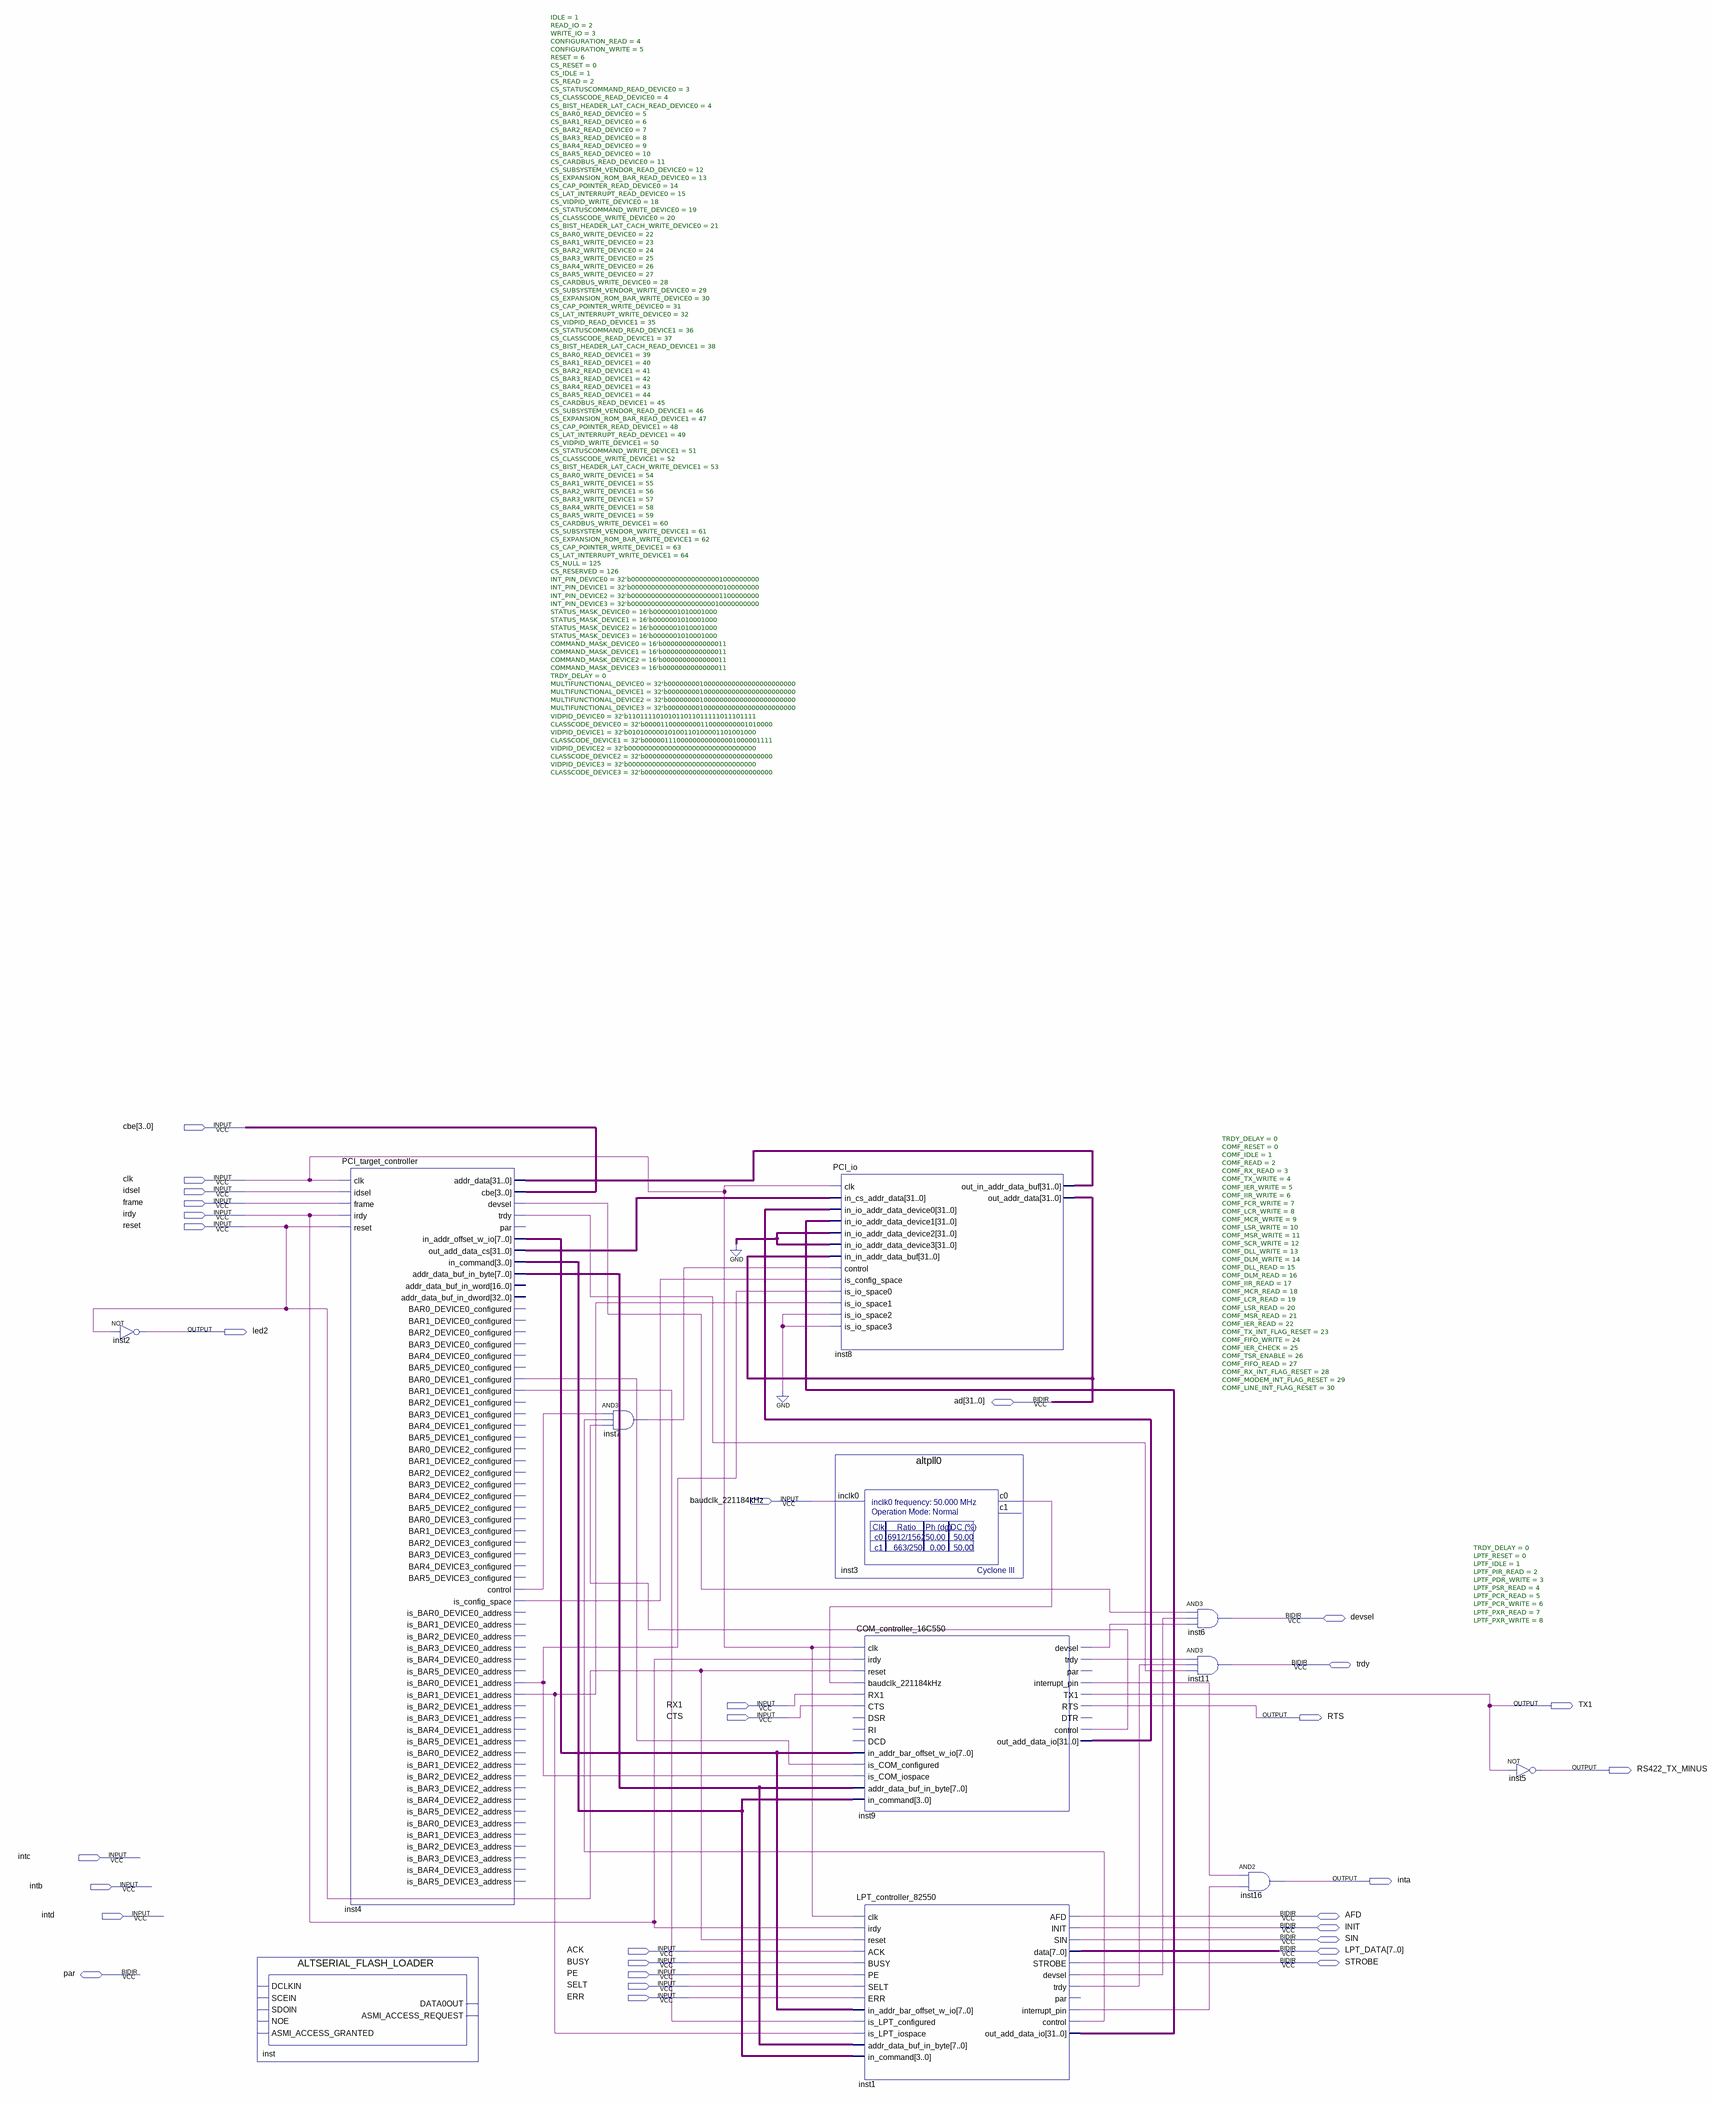
[diagram p0: schematic sheet]
// Quartus schematic Block1.bdf as structural Verilog: 12 symbols, 31 pins
module Block1 (
  input  [3:0] cbe,
  input  clk,
  input  idsel,
  input  frame,
  input  irdy,
  input  reset,
  input  baudclk_221184kHz,
  input  RX1,
  input  CTS,
  input  intc,
  input  intb,
  input  intd,
  input  ACK,
  input  BUSY,
  input  PE,
  input  SELT,
  input  ERR,
  inout  [31:0] ad,
  inout  devsel,
  inout  trdy,
  inout  AFD,
  inout  INIT,
  inout  SIN,
  inout  [7:0] LPT_DATA,
  inout  STROBE,
  inout  par,
  output led2,
  output TX1,
  output RTS,
  output RS422_TX_MINUS,
  output inta
);

  wire inst1_control, inst1_devsel, inst1_interrupt_pin, inst1_trdy, inst3_c0, inst4_bar0_device1_configured,
       inst4_bar1_device1_configured, inst4_control, inst4_devsel, inst4_is_bar0_device1_address,
       inst4_is_bar1_device1_address, inst4_is_config_space, inst4_trdy, inst7_out, inst9_control,
       inst9_devsel, inst9_interrupt_pin, inst9_trdy;
  wire [3:0] inst4_in_command;
  wire [7:0] inst4_addr_data_buf_in_byte, inst4_in_addr_offset_w_io;
  wire [31:0] inst1_out_add_data_io, inst4_addr_data, inst4_out_add_data_cs, inst9_out_add_data_io;

  not inst2 (led2, reset);
  ALTSERIAL_FLASH_LOADER inst ();  // open: DCLKIN, SCEIN, SDOIN, NOE, ASMI_ACCESS_GRANTED, DATA0OUT, ASMI_ACCESS_REQUEST
  PCI_target_controller #(.IDLE(1), .READ_IO(2), .WRITE_IO(3), .CONFIGURATION_READ(4), .CONFIGURATION_WRITE(5), .RESET(6), .CS_RESET(0), .CS_IDLE(1), .CS_READ(2), .CS_STATUSCOMMAND_READ_DEVICE0(3), .CS_CLASSCODE_READ_DEVICE0(4), .CS_BIST_HEADER_LAT_CACH_READ_DEVICE0(4), .CS_BAR0_READ_DEVICE0(5), .CS_BAR1_READ_DEVICE0(6), .CS_BAR2_READ_DEVICE0(7), .CS_BAR3_READ_DEVICE0(8), .CS_BAR4_READ_DEVICE0(9), .CS_BAR5_READ_DEVICE0(10), .CS_CARDBUS_READ_DEVICE0(11), .CS_SUBSYSTEM_VENDOR_READ_DEVICE0(12), .CS_EXPANSION_ROM_BAR_READ_DEVICE0(13), .CS_CAP_POINTER_READ_DEVICE0(14), .CS_LAT_INTERRUPT_READ_DEVICE0(15), .CS_VIDPID_WRITE_DEVICE0(18), .CS_STATUSCOMMAND_WRITE_DEVICE0(19), .CS_CLASSCODE_WRITE_DEVICE0(20), .CS_BIST_HEADER_LAT_CACH_WRITE_DEVICE0(21), .CS_BAR0_WRITE_DEVICE0(22), .CS_BAR1_WRITE_DEVICE0(23), .CS_BAR2_WRITE_DEVICE0(24), .CS_BAR3_WRITE_DEVICE0(25), .CS_BAR4_WRITE_DEVICE0(26), .CS_BAR5_WRITE_DEVICE0(27), .CS_CARDBUS_WRITE_DEVICE0(28), .CS_SUBSYSTEM_VENDOR_WRITE_DEVICE0(29), .CS_EXPANSION_ROM_BAR_WRITE_DEVICE0(30), .CS_CAP_POINTER_WRITE_DEVICE0(31), .CS_LAT_INTERRUPT_WRITE_DEVICE0(32), .CS_VIDPID_READ_DEVICE1(35), .CS_STATUSCOMMAND_READ_DEVICE1(36), .CS_CLASSCODE_READ_DEVICE1(37), .CS_BIST_HEADER_LAT_CACH_READ_DEVICE1(38), .CS_BAR0_READ_DEVICE1(39), .CS_BAR1_READ_DEVICE1(40), .CS_BAR2_READ_DEVICE1(41), .CS_BAR3_READ_DEVICE1(42), .CS_BAR4_READ_DEVICE1(43), .CS_BAR5_READ_DEVICE1(44), .CS_CARDBUS_READ_DEVICE1(45), .CS_SUBSYSTEM_VENDOR_READ_DEVICE1(46), .CS_EXPANSION_ROM_BAR_READ_DEVICE1(47), .CS_CAP_POINTER_READ_DEVICE1(48), .CS_LAT_INTERRUPT_READ_DEVICE1(49), .CS_VIDPID_WRITE_DEVICE1(50), .CS_STATUSCOMMAND_WRITE_DEVICE1(51), .CS_CLASSCODE_WRITE_DEVICE1(52), .CS_BIST_HEADER_LAT_CACH_WRITE_DEVICE1(53), .CS_BAR0_WRITE_DEVICE1(54), .CS_BAR1_WRITE_DEVICE1(55), .CS_BAR2_WRITE_DEVICE1(56), .CS_BAR3_WRITE_DEVICE1(57), .CS_BAR4_WRITE_DEVICE1(58), .CS_BAR5_WRITE_DEVICE1(59), .CS_CARDBUS_WRITE_DEVICE1(60), .CS_SUBSYSTEM_VENDOR_WRITE_DEVICE1(61), .CS_EXPANSION_ROM_BAR_WRITE_DEVICE1(62), .CS_CAP_POINTER_WRITE_DEVICE1(63), .CS_LAT_INTERRUPT_WRITE_DEVICE1(64), .CS_NULL(125), .CS_RESERVED(126), .INT_PIN_DEVICE0(32'b00000000000000000000001000000000), .INT_PIN_DEVICE1(32'b00000000000000000000000100000000), .INT_PIN_DEVICE2(32'b00000000000000000000001100000000), .INT_PIN_DEVICE3(32'b00000000000000000000010000000000), .STATUS_MASK_DEVICE0(16'b0000001010001000), .STATUS_MASK_DEVICE1(16'b0000001010001000), .STATUS_MASK_DEVICE2(16'b0000001010001000), .STATUS_MASK_DEVICE3(16'b0000001010001000), .COMMAND_MASK_DEVICE0(16'b0000000000000011), .COMMAND_MASK_DEVICE1(16'b0000000000000011), .COMMAND_MASK_DEVICE2(16'b0000000000000011), .COMMAND_MASK_DEVICE3(16'b0000000000000011), .TRDY_DELAY(0), .MULTIFUNCTIONAL_DEVICE0(32'b00000000100000000000000000000000), .MULTIFUNCTIONAL_DEVICE1(32'b00000000100000000000000000000000), .MULTIFUNCTIONAL_DEVICE2(32'b00000000100000000000000000000000), .MULTIFUNCTIONAL_DEVICE3(32'b00000000100000000000000000000000), .VIDPID_DEVICE0(32'b11011110101011011011111011101111), .CLASSCODE_DEVICE0(32'b00001100000000110000000001010000), .VIDPID_DEVICE1(32'b01010000010100110100001101001000), .CLASSCODE_DEVICE1(32'b00000111000000000000001000001111), .VIDPID_DEVICE2(32'b00000000000000000000000000000000), .CLASSCODE_DEVICE2(32'b00000000000000000000000000000000), .VIDPID_DEVICE3(32'b00000000000000000000000000000000), .CLASSCODE_DEVICE3(32'b00000000000000000000000000000000)) inst4 (
    .clk(clk), .idsel(idsel), .frame(frame), .irdy(irdy), .reset(reset),
    .in_addr_offset_w_io(inst4_in_addr_offset_w_io), .out_add_data_cs(inst4_out_add_data_cs),
    .in_command(inst4_in_command), .addr_data_buf_in_byte(inst4_addr_data_buf_in_byte),
    .BAR0_DEVICE1_configured(inst4_bar0_device1_configured),
    .BAR1_DEVICE1_configured(inst4_bar1_device1_configured), .control(inst4_control),
    .is_config_space(inst4_is_config_space), .is_BAR0_DEVICE1_address(inst4_is_bar0_device1_address),
    .is_BAR1_DEVICE1_address(inst4_is_bar1_device1_address), .addr_data(inst4_addr_data), .cbe(cbe),
    .devsel(inst4_devsel), .trdy(inst4_trdy));  // open: par, addr_data_buf_in_word, addr_data_buf_in_dword, BAR0_DEVICE0_configured, BAR1_DEVICE0_configured, BAR2_DEVICE0_configured, BAR3_DEVICE0_configured, BAR4_DEVICE0_configured, BAR5_DEVICE0_configured, BAR2_DEVICE1_configured, BAR3_DEVICE1_configured, BAR4_DEVICE1_configured, BAR5_DEVICE1_configured, BAR0_DEVICE2_configured, BAR1_DEVICE2_configured, BAR2_DEVICE2_configured, BAR3_DEVICE2_configured, BAR4_DEVICE2_configured, BAR5_DEVICE2_configured, BAR0_DEVICE3_configured, BAR1_DEVICE3_configured, BAR2_DEVICE3_configured, BAR3_DEVICE3_configured, BAR4_DEVICE3_configured, BAR5_DEVICE3_configured, is_BAR0_DEVICE0_address, is_BAR1_DEVICE0_address, is_BAR2_DEVICE0_address, is_BAR3_DEVICE0_address, is_BAR4_DEVICE0_address, is_BAR5_DEVICE0_address, is_BAR2_DEVICE1_address, is_BAR3_DEVICE1_address, is_BAR4_DEVICE1_address, is_BAR5_DEVICE1_address, is_BAR0_DEVICE2_address, is_BAR1_DEVICE2_address, is_BAR2_DEVICE2_address, is_BAR3_DEVICE2_address, is_BAR4_DEVICE2_address, is_BAR5_DEVICE2_address, is_BAR0_DEVICE3_address, is_BAR1_DEVICE3_address, is_BAR2_DEVICE3_address, is_BAR3_DEVICE3_address, is_BAR4_DEVICE3_address, is_BAR5_DEVICE3_address
  and inst7 (inst7_out, inst4_control, inst1_control, inst9_control);
  PCI_io inst8 (
    .clk(clk), .in_cs_addr_data(inst4_out_add_data_cs), .in_io_addr_data_device0(inst9_out_add_data_io),
    .in_io_addr_data_device1(inst1_out_add_data_io), .in_io_addr_data_device2({32{1'b0}}),
    .in_io_addr_data_device3({32{1'b0}}), .in_in_addr_data_buf(ad), .control(inst7_out),
    .is_config_space(inst4_is_config_space), .is_io_space0(inst4_is_bar0_device1_address),
    .is_io_space1(inst4_is_bar1_device1_address), .is_io_space2(1'b0), .is_io_space3(1'b0),
    .out_in_addr_data_buf(inst4_addr_data), .out_addr_data(ad));
  altpll0 inst3 (.inclk0(baudclk_221184kHz), .c0(inst3_c0));  // open: c1
  COM_controller_16C550 #(.TRDY_DELAY(0), .COMF_RESET(0), .COMF_IDLE(1), .COMF_READ(2), .COMF_RX_READ(3), .COMF_TX_WRITE(4), .COMF_IER_WRITE(5), .COMF_IIR_WRITE(6), .COMF_FCR_WRITE(7), .COMF_LCR_WRITE(8), .COMF_MCR_WRITE(9), .COMF_LSR_WRITE(10), .COMF_MSR_WRITE(11), .COMF_SCR_WRITE(12), .COMF_DLL_WRITE(13), .COMF_DLM_WRITE(14), .COMF_DLL_READ(15), .COMF_DLM_READ(16), .COMF_IIR_READ(17), .COMF_MCR_READ(18), .COMF_LCR_READ(19), .COMF_LSR_READ(20), .COMF_MSR_READ(21), .COMF_IER_READ(22), .COMF_TX_INT_FLAG_RESET(23), .COMF_FIFO_WRITE(24), .COMF_IER_CHECK(25), .COMF_TSR_ENABLE(26), .COMF_FIFO_READ(27), .COMF_RX_INT_FLAG_RESET(28), .COMF_MODEM_INT_FLAG_RESET(29), .COMF_LINE_INT_FLAG_RESET(30)) inst9 (
    .clk(clk), .irdy(irdy), .reset(reset), .baudclk_221184kHz(inst3_c0), .RX1(RX1), .CTS(CTS),
    .in_addr_bar_offset_w_io(inst4_in_addr_offset_w_io), .is_COM_configured(inst4_bar0_device1_configured),
    .is_COM_iospace(inst4_is_bar0_device1_address), .addr_data_buf_in_byte(inst4_addr_data_buf_in_byte),
    .in_command(inst4_in_command), .devsel(inst9_devsel), .trdy(inst9_trdy),
    .interrupt_pin(inst9_interrupt_pin), .TX1(TX1), .RTS(RTS), .control(inst9_control),
    .out_add_data_io(inst9_out_add_data_io));  // open: DSR, RI, DCD, par, DTR
  LPT_controller_82550 #(.TRDY_DELAY(0), .LPTF_RESET(0), .LPTF_IDLE(1), .LPTF_PIR_READ(2), .LPTF_PDR_WRITE(3), .LPTF_PSR_READ(4), .LPTF_PCR_READ(5), .LPTF_PCR_WRITE(6), .LPTF_PXR_READ(7), .LPTF_PXR_WRITE(8)) inst1 (
    .clk(clk), .irdy(irdy), .reset(reset), .ACK(ACK), .BUSY(BUSY), .PE(PE), .SELT(SELT), .ERR(ERR),
    .in_addr_bar_offset_w_io(inst4_in_addr_offset_w_io), .is_LPT_configured(inst4_bar1_device1_configured),
    .is_LPT_iospace(inst4_is_bar1_device1_address), .addr_data_buf_in_byte(inst4_addr_data_buf_in_byte),
    .in_command(inst4_in_command), .devsel(inst1_devsel), .trdy(inst1_trdy),
    .interrupt_pin(inst1_interrupt_pin), .control(inst1_control), .out_add_data_io(inst1_out_add_data_io),
    .AFD(AFD), .INIT(INIT), .SIN(SIN), .data(LPT_DATA), .STROBE(STROBE));  // open: par
  and inst6 (devsel, inst4_devsel, inst1_devsel, inst9_devsel);
  and inst11 (trdy, inst9_trdy, inst1_trdy, inst4_trdy);
  and inst16 (inta, inst9_interrupt_pin, inst1_interrupt_pin);
  not inst5 (RS422_TX_MINUS, TX1);
endmodule
